# Altium schematic sheet 24line-control-panel.SchDoc
size B; SheetNumber: 1; SheetTotal: 1
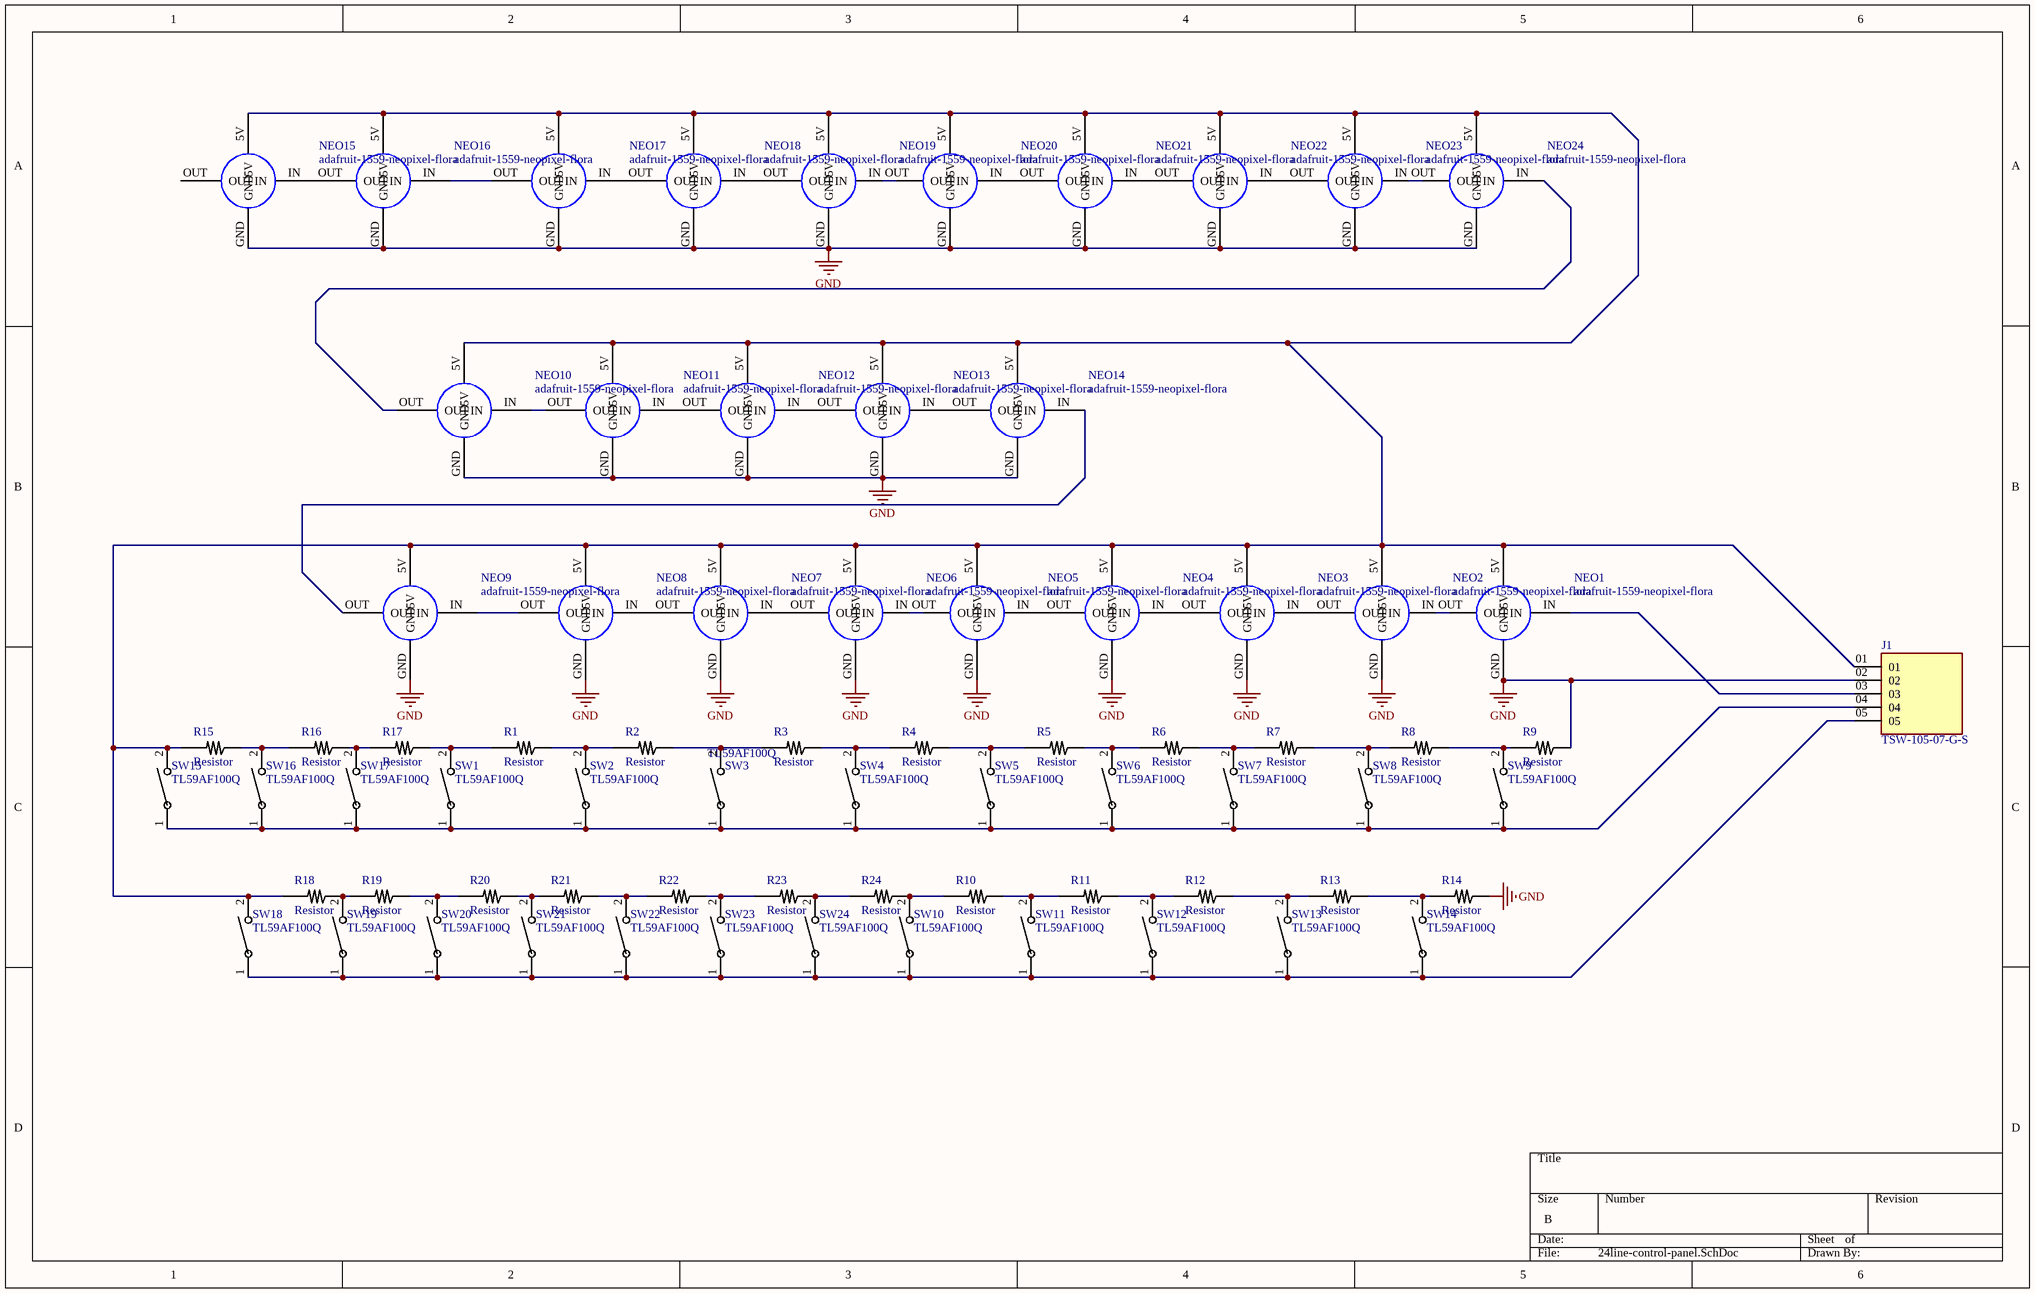
[diagram p0: 24line-control-panel.SchDoc]

## Parts
J1  TSW-105-07-G-S  [SAMTEC_TSW-105-07-G-S]
NEO1  adafruit-1559-neopixel-flora  [adafruit-1559-neopixel-flora]
NEO2  adafruit-1559-neopixel-flora  [adafruit-1559-neopixel-flora]
NEO3  adafruit-1559-neopixel-flora  [adafruit-1559-neopixel-flora]
NEO4  adafruit-1559-neopixel-flora  [adafruit-1559-neopixel-flora]
NEO5  adafruit-1559-neopixel-flora  [adafruit-1559-neopixel-flora]
NEO6  adafruit-1559-neopixel-flora  [adafruit-1559-neopixel-flora]
NEO7  adafruit-1559-neopixel-flora  [adafruit-1559-neopixel-flora]
NEO8  adafruit-1559-neopixel-flora  [adafruit-1559-neopixel-flora]
NEO9  adafruit-1559-neopixel-flora  [adafruit-1559-neopixel-flora]
NEO10  adafruit-1559-neopixel-flora  [adafruit-1559-neopixel-flora]
NEO11  adafruit-1559-neopixel-flora  [adafruit-1559-neopixel-flora]
NEO12  adafruit-1559-neopixel-flora  [adafruit-1559-neopixel-flora]
NEO13  adafruit-1559-neopixel-flora  [adafruit-1559-neopixel-flora]
NEO14  adafruit-1559-neopixel-flora  [adafruit-1559-neopixel-flora]
NEO15  adafruit-1559-neopixel-flora  [adafruit-1559-neopixel-flora]
NEO16  adafruit-1559-neopixel-flora  [adafruit-1559-neopixel-flora]
NEO17  adafruit-1559-neopixel-flora  [adafruit-1559-neopixel-flora]
NEO18  adafruit-1559-neopixel-flora  [adafruit-1559-neopixel-flora]
NEO19  adafruit-1559-neopixel-flora  [adafruit-1559-neopixel-flora]
NEO20  adafruit-1559-neopixel-flora  [adafruit-1559-neopixel-flora]
NEO21  adafruit-1559-neopixel-flora  [adafruit-1559-neopixel-flora]
NEO22  adafruit-1559-neopixel-flora  [adafruit-1559-neopixel-flora]
NEO23  adafruit-1559-neopixel-flora  [adafruit-1559-neopixel-flora]
NEO24  adafruit-1559-neopixel-flora  [adafruit-1559-neopixel-flora]
R1  Resistor  [thruhole resistor]
R2  Resistor  [thruhole resistor]
R3  Resistor  [thruhole resistor]
R4  Resistor  [thruhole resistor]
R5  Resistor  [thruhole resistor]
R6  Resistor  [thruhole resistor]
R7  Resistor  [thruhole resistor]
R8  Resistor  [thruhole resistor]
R9  Resistor  [thruhole resistor]
R10  Resistor  [thruhole resistor]
R11  Resistor  [thruhole resistor]
R12  Resistor  [thruhole resistor]
R13  Resistor  [thruhole resistor]
R14  Resistor  [thruhole resistor]
R15  Resistor  [thruhole resistor]
R16  Resistor  [thruhole resistor]
R17  Resistor  [thruhole resistor]
R18  Resistor  [thruhole resistor]
R19  Resistor  [thruhole resistor]
R20  Resistor  [thruhole resistor]
R21  Resistor  [thruhole resistor]
R22  Resistor  [thruhole resistor]
R23  Resistor  [thruhole resistor]
R24  Resistor  [thruhole resistor]
SW1  TL59AF100Q  [SW_TL59AF100Q_EWI]
SW2  TL59AF100Q  [SW_TL59AF100Q_EWI]
SW3  TL59AF100Q  [SW_TL59AF100Q_EWI]
SW4  TL59AF100Q  [SW_TL59AF100Q_EWI]
SW5  TL59AF100Q  [SW_TL59AF100Q_EWI]
SW6  TL59AF100Q  [SW_TL59AF100Q_EWI]
SW7  TL59AF100Q  [SW_TL59AF100Q_EWI]
SW8  TL59AF100Q  [SW_TL59AF100Q_EWI]
SW9  TL59AF100Q  [SW_TL59AF100Q_EWI]
SW10  TL59AF100Q  [SW_TL59AF100Q_EWI]
SW11  TL59AF100Q  [SW_TL59AF100Q_EWI]
SW12  TL59AF100Q  [SW_TL59AF100Q_EWI]
SW13  TL59AF100Q  [SW_TL59AF100Q_EWI]
SW14  TL59AF100Q  [SW_TL59AF100Q_EWI]
SW15  TL59AF100Q  [SW_TL59AF100Q_EWI]
SW16  TL59AF100Q  [SW_TL59AF100Q_EWI]
SW17  TL59AF100Q  [SW_TL59AF100Q_EWI]
SW18  TL59AF100Q  [SW_TL59AF100Q_EWI]
SW19  TL59AF100Q  [SW_TL59AF100Q_EWI]
SW20  TL59AF100Q  [SW_TL59AF100Q_EWI]
SW21  TL59AF100Q  [SW_TL59AF100Q_EWI]
SW22  TL59AF100Q  [SW_TL59AF100Q_EWI]
SW23  TL59AF100Q  [SW_TL59AF100Q_EWI]
SW24  TL59AF100Q  [SW_TL59AF100Q_EWI]

## Nets
GND: J1.02 NEO1.GND NEO2.GND NEO3.GND NEO4.GND NEO5.GND NEO6.GND NEO7.GND NEO8.GND NEO9.GND NEO10.GND NEO11.GND NEO12.GND NEO13.GND NEO14.GND NEO15.GND NEO16.GND NEO17.GND NEO18.GND NEO19.GND NEO20.GND NEO21.GND NEO22.GND NEO23.GND NEO24.GND R9.1 R14.1
NetJ1_01: J1.01 NEO1.5V NEO2.5V NEO3.5V NEO4.5V NEO5.5V NEO6.5V NEO7.5V NEO8.5V NEO9.5V NEO10.5V NEO11.5V NEO12.5V NEO13.5V NEO14.5V NEO15.5V NEO16.5V NEO17.5V NEO18.5V NEO19.5V NEO20.5V NEO21.5V NEO22.5V NEO23.5V NEO24.5V R15.2 R18.2 SW15.2 SW18.2
NetJ1_03: J1.03 NEO1.IN
NetJ1_04: J1.04 SW1.1 SW2.1 SW3.1 SW4.1 SW5.1 SW6.1 SW7.1 SW8.1 SW9.1 SW15.1 SW16.1 SW17.1
NetJ1_05: J1.05 SW10.1 SW11.1 SW12.1 SW13.1 SW14.1 SW18.1 SW19.1 SW20.1 SW21.1 SW22.1 SW23.1 SW24.1
NetNEO1_OUT: NEO1.OUT NEO2.IN
NetNEO2_OUT: NEO2.OUT NEO3.IN
NetNEO3_OUT: NEO3.OUT NEO4.IN
NetNEO4_OUT: NEO4.OUT NEO5.IN
NetNEO5_OUT: NEO5.OUT NEO6.IN
NetNEO6_OUT: NEO6.OUT NEO7.IN
NetNEO7_OUT: NEO7.OUT NEO8.IN
NetNEO8_OUT: NEO8.OUT NEO9.IN
NetNEO9_OUT: NEO9.OUT NEO14.IN
NetNEO10_IN: NEO10.IN NEO11.OUT
NetNEO10_OUT: NEO10.OUT NEO24.IN
NetNEO11_IN: NEO11.IN NEO12.OUT
NetNEO12_IN: NEO12.IN NEO13.OUT
NetNEO13_IN: NEO13.IN NEO14.OUT
NetNEO15_IN: NEO15.IN NEO16.OUT
NetNEO16_IN: NEO16.IN NEO17.OUT
NetNEO17_IN: NEO17.IN NEO18.OUT
NetNEO18_IN: NEO18.IN NEO19.OUT
NetNEO19_IN: NEO19.IN NEO20.OUT
NetNEO20_IN: NEO20.IN NEO21.OUT
NetNEO21_IN: NEO21.IN NEO22.OUT
NetNEO22_IN: NEO22.IN NEO23.OUT
NetNEO23_IN: NEO23.IN NEO24.OUT
NetR1_1: R1.1 R2.2 SW2.2
NetR1_2: R1.2 R17.1 SW1.2
NetR2_1: R2.1 R3.2 SW3.2
NetR3_1: R3.1 R4.2 SW4.2
NetR4_1: R4.1 R5.2 SW5.2
NetR5_1: R5.1 R6.2 SW6.2
NetR6_1: R6.1 R7.2 SW7.2
NetR7_1: R7.1 R8.2 SW8.2
NetR8_1: R8.1 R9.2 SW9.2
NetR10_1: R10.1 R11.2 SW11.2
NetR10_2: R10.2 R24.1 SW10.2
NetR11_1: R11.1 R12.2 SW12.2
NetR12_1: R12.1 R13.2 SW13.2
NetR13_1: R13.1 R14.2 SW14.2
NetR15_1: R15.1 R16.2 SW16.2
NetR16_1: R16.1 R17.2 SW17.2
NetR18_1: R18.1 R19.2 SW19.2
NetR19_1: R19.1 R20.2 SW20.2
NetR20_1: R20.1 R21.2 SW21.2
NetR21_1: R21.1 R22.2 SW22.2
NetR22_1: R22.1 R23.2 SW23.2
NetR23_1: R23.1 R24.2 SW24.2

Not connected (* = marked no-connect by the designer): NEO15 OUT

## Library data of the parts
J1 = TSW-105-07-G-S: MF: Samtec Inc.; Package: None; MP: TSW-105-07-G-S; Price: None; Availability: Unavailable; Value: *
SW1-SW24 = TL59AF100Q: No Description Available; Mfr_Name: E-Switch; Copyright: Copyright (C) 2024 Ultra Librarian. All rights reserved.; Manufacturer_Part_Number: TL59AF100Q; RefDes: RefDes; Type: DEV